# Altium schematic sheet PG3 SHEET1.schdoc
size B; Date: 2/10/2009; ApprovedBy: Touraj; DrawnBy: Juan A. Nadal; Engineer: Touraj; Organization: ActiveWave; Address1: 902 Clint Moore Rd., Suite 118; Address2: Boca Raton; Address3: FL, 33487; Address4: 561-999-9422; DocumentNumber: 3; Revision: 20; SheetNumber: 3; SheetTotal: 4; PageSetup: Record=PageOptions|CenterHorizontal=True|CenterVertical=True|PrintScale=0.70|XCorrection=1.00|YCorrection=1.00|PrintKind=0|BorderSize=5000000|LeftOffset=0|BottomOffset=0|Orientation=2|PaperLength=1000|PaperWidth=1000|Scale=100|PaperSource=7|PrintQuality=-4|MediaType=1|DitherType=10|PaperKind=Letter|PrintScaleMode=1; Project: Tag103
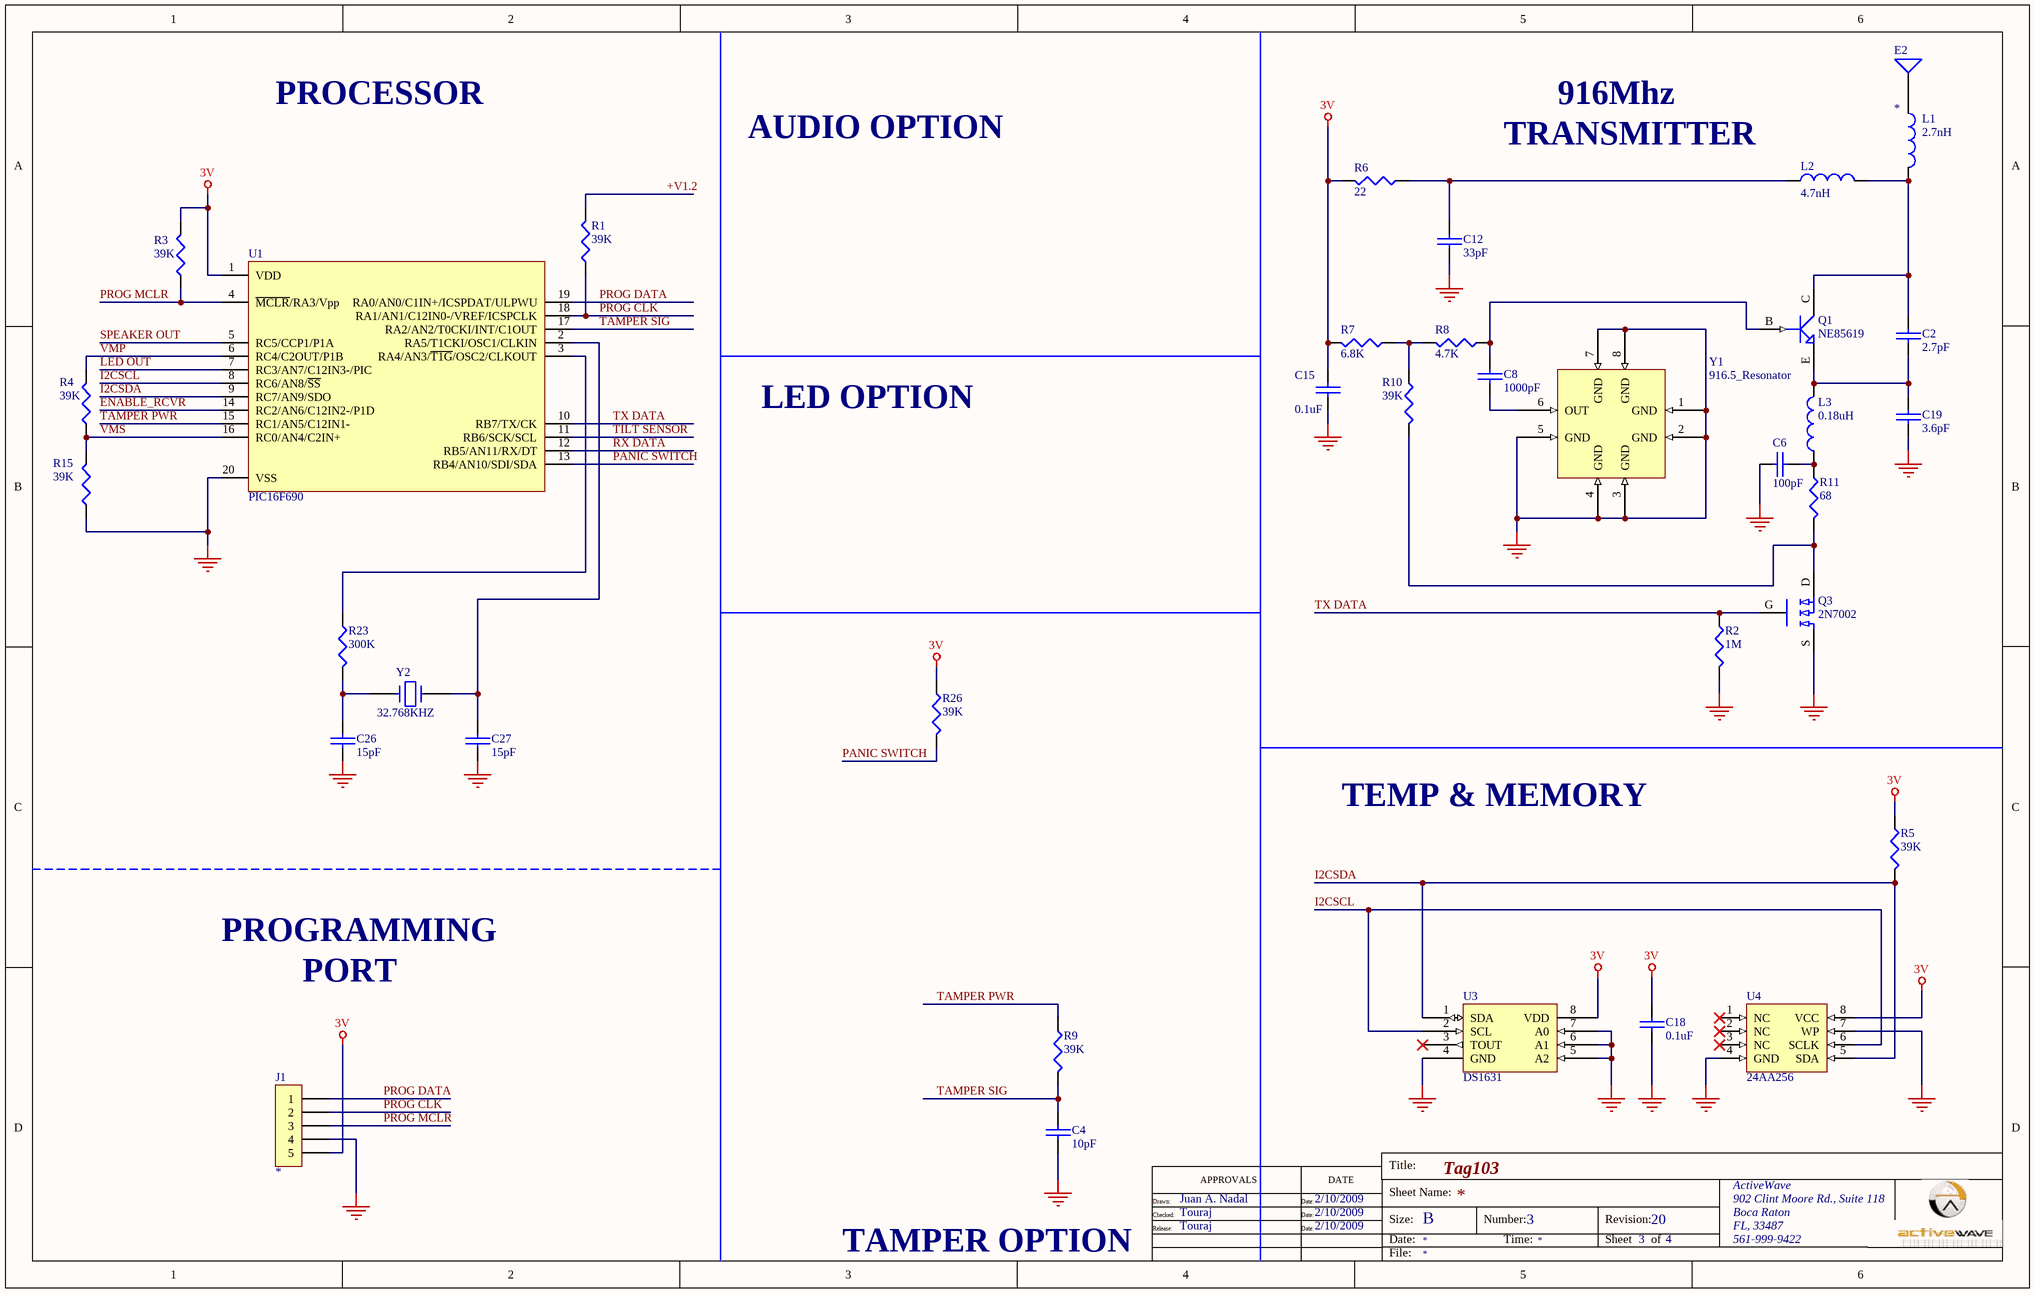
[diagram p0: PG3 SHEET1.schdoc]

## Parts
C2  value 2.7pF  [0603]  (hidden comment: 2 PF)
C4  10pF  [0603]
C6  value 100pF  [0603]  (hidden comment: 100 pF)
C8  value 1000pF  [0603]  (hidden comment: 1000 pF)
C12  value 33pF  [0603]  (hidden comment: 33 pF)
C15  value 0.1uF  [0603]  (hidden comment: 0.1 uF)
C18  value 0.1uF  [0603]  (hidden comment: 0.1 uF)
C19  value 3.6pF  [0603]  (hidden comment: 2.7 pF)
C26  15pF  [0603]
C27  15pF  [0603]
E2  *  [Antenna1]
J1  1X5 HEADER  [CONN5]  (value not drawn)
L1  2.7nH  [0603]
L2  value 4.7nH  [0603]  (hidden comment: 10nH)
L3  0.18uH  [0603]
Q1  NE85619  [3 PIN ULTRA SUPER MINI MOLD]
Q3  2N7002  [SOT23 FET]
R1  39K  [0603]
R2  value 1M  (hidden comment: 1 M)
R3  39K  [0603]
R4  39K  [0603]
R5  39K  [0603]
R6  22
R7  6.8K
R8  value 4.7K  (hidden comment: 4.7 K)
R9  39K  [0603]
R10  39K  [0603]
R11  68
R15  39K  [0603]
R23  300K  [0603]
R26  value 39K  [0603]  (hidden comment: 4.7M)
U1  PIC16F690  [SSOP20 WIDE]
U3  DS1631  [SO8 SMALL]
U4  24AA256  [SO8]
Y1  916.5_Resonator  [RESONATOR]
Y2  value 32.768KHZ  [CRYSTAL ABRACON ABS07]  (hidden comment: 32.768KHZ CRYSTAL)

## Nets
3V: C15.1 C18.1 J1.5 R3.2 R5.1 R6.2 R7.2 R26.1 U1.1(VDD) U3.8(VDD) U4.8(VCC)
GND: C4.2 C6.2 C12.2 C15.2 C18.2 C19.2 C26.2 C27.2 J1.4 Q3.S R2.2 R15.1 U1.20(VSS) U3.4(GND) U3.5(A2) U3.6(A1) U3.7(A0) U4.4(GND) U4.7(WP) Y1.1(GND) Y1.2(GND) Y1.3(GND) Y1.4(GND) Y1.5(GND) Y1.7(GND) Y1.8(GND)
+V1.2: R1.2
ENABLE_RCVR: U1.14(RC2/AN6/C12IN2-/P1D)
I2CSCL: U1.8(RC6/AN8/~{SS}) U3.2(SCL) U4.6(SCLK)
I2CSDA: R5.2 U1.9(RC7/AN9/SDO) U3.1(SDA) U4.5(SDA)
LED OUT: U1.7(RC3/AN7/C12IN3-/PIC)
PANIC SWITCH: R26.2 U1.13(RB4/AN10/SDI/SDA)
PROG CLK: J1.2 R1.1 U1.18(RA1/AN1/C12IN0-/VREF/ICSPCLK)
PROG DATA: J1.1 U1.19(RA0/AN0/C1IN+/ICSPDAT/ULPWU)
PROG MCLR: J1.3 R3.1 U1.4(~{MCLR}/RA3/Vpp)
RX DATA: U1.12(RB5/AN11/RX/DT)
SPEAKER OUT: U1.5(RC5/CCP1/P1A)
TAMPER PWR: R9.1 U1.15(RC1/AN5/C12IN1-)
TAMPER SIG: C4.1 R9.2 U1.17(RA2/AN2/T0CKI/INT/C1OUT)
TILT SENSOR: U1.11(RB6/SCK/SCL)
TX DATA: Q3.G R2.1 U1.10(RB7/TX/CK)
VMP: R4.2 U1.6(RC4/C2OUT/P1B)
VMS: R4.1 R15.2 U1.16(RC0/AN4/C2IN+)
NetC2_1: C2.1 L1.2 L2.2 Q1.C
NetC2_2: C2.2 C19.1 L3.2 Q1.E
NetC6_1: C6.1 L3.1 R11.1
NetC8_1: C8.1 Q1.B R8.1
NetC8_2: C8.2 Y1.6(OUT)
NetC12_1: C12.1 L2.1 R6.1
NetC26_1: C26.1 R23.2 Y2.1
NetC27_1: C27.1 U1.2(RA5/T1CKI/OSC1/CLKIN) Y2.2
NetE2_1: E2.1 L1.1
NetQ3_D: Q3.D R10.2 R11.2
NetR7_1: R7.1 R8.2 R10.1
NetR23_1: R23.1 U1.3(RA4/AN3/~{T1G}/OSC2/CLKOUT)

Not connected (* = marked no-connect by the designer): U3 3(TOUT)*; U4 1(NC)* 2(NC)* 3(NC)*

## Notes on the sheet
- PROCESSOR
- AUDIO OPTION
- TRANSMITTER
- 916Mhz
- LED OPTION
- TEMP & MEMORY
- PROGRAMMING
- PORT
- TAMPER OPTION
- APPROVALS
- DATE
- Title:
- Drawn:
- Checked:
- Release:
- Date:
- Size:
- Sheet Name:
- B
- Number:
- Time:
- Revision:
- Sheet
- of
- File:

## Library data of the parts
C2 C4 C6 C8 C12 C15 C18 C19 C26 C27 = CAP-0603: Capacitor; ACTIVEWAVE-P/N: *; ITEM-DESCRIPTION: *; MANUFACTURER: *; MFGR-P/N: *
  C4: VALUE: 10pF
  C26 C27: VALUE: 15pF
E2 = Antenna1: PART-VALUE: *
J1 = CON5: Connector; ACTIVEWAVE-P/N: *; ITEM-DESCRIPTION: *; MANUFACTURER: *; MFGR-P/N: *; PART-VALUE: *
L1-L3 = INDUCTOR: ACTIVEWAVE-P/N: *; ITEM-DESCRIPTION: *; MANUFACTURER: *; MFGR-P/N: *
  L1: VALUE: 2.7nH
  L3: VALUE: 0.18uH
Q1 = NE85619: NPN Transistor; ACTIVEWAVE-P/N: *; ITEM-DESCRIPTION: *; MANUFACTURER: *; MFGR-P/N: *; VALUE: NE85619
R1 R3-R5 R9 R10 R15 R23 R26 = RES-0603: ACTIVEWAVE-P/N: *; MFGR-P/N: *; MANUFACTURER: *; ITEM-DESCRIPTION: *
  R1 R3-R5 R9 R10 R15: VALUE: 39K
  R23: VALUE: 300K
R2 R6-R8 R11 = RES-0402: ACTIVEWAVE-P/N: *; MFGR-P/N: *; MANUFACTURER: *; ITEM-DESCRIPTION: *
  R6: VALUE: 22
  R7: VALUE: 6.8K
  R11: VALUE: 68
Y1 = RESONATOR: ACTIVEWAVE-P/N: *; ITEM-DESCRIPTION: *; MANUFACTURER: *; MFGR-P/N: *; VALUE: 916.5_Resonator
Y2 = CRYSTAL: ACTIVEWAVE-P/N: *; MANUFACTURER: *; ITEM-DESCRIPTION: *; MFGR-P/N: *
Q3 = 2N7002: ACTIVEWAVE-P/N: *; ITEM-DESCRIPTION: *; MANUFACTURER: *; MFGR-P/N: *; VALUE: 2N7002
U1 = PIC16F690: ACTIVEWAVE-P/N: *; ITEM-DESCRIPTION: *; MANUFACTURER: *; MFGR-P/N: *; VALUE: PIC16F690
U3 = DS1631: ACTIVEWAVE-P/N: *; ITEM-DECRIPTION: *; MANUFACTURER: *; MFGR-P/N: *; VALUE: DS1631
U4 = 24AA256: ACTIVEWAVE-P/N: *; MFGR-P/N: *; MANUFACTURER: *; ITEM-DESCRIPTION: *; VALUE: 24AA256